# EAGLE design icp_dcs (EAGLE 6.3)
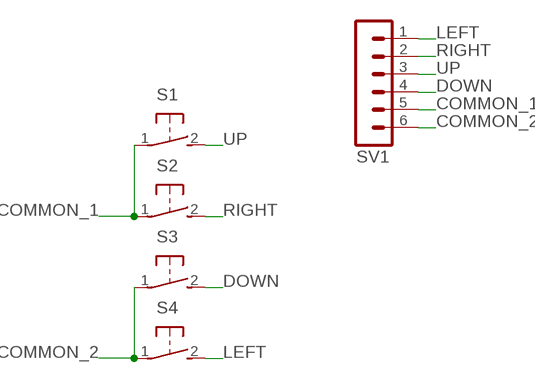
[diagram p0: schematic, sheet 1]

## Parts
S1  31-XX  [B3F-31XX]
S2  31-XX  [B3F-31XX]
S3  31-XX  [B3F-31XX]
S4  31-XX  [B3F-31XX]
SV1  MA06-1  [MA06-1]

## Nets
COMMON_1: S1.1(P) S2.1(P) SV1.5
COMMON_2: S3.1(P) S4.1(P) SV1.6
DOWN: S3.2(S) SV1.4
LEFT: S4.2(S) SV1.1
RIGHT: S2.2(S) SV1.2
UP: S1.2(S) SV1.3

## Library data of the parts
S1-S4 = switch-omron:31-XX: OMRON SWITCH; MPN: B3F-3100; OC_FARNELL: 959704; OC_NEWARK: 36M3582
SV1 = con-lstb:MA06-1: PIN HEADER; OC_FARNELL: unknown; OC_NEWARK: unknown

## Board
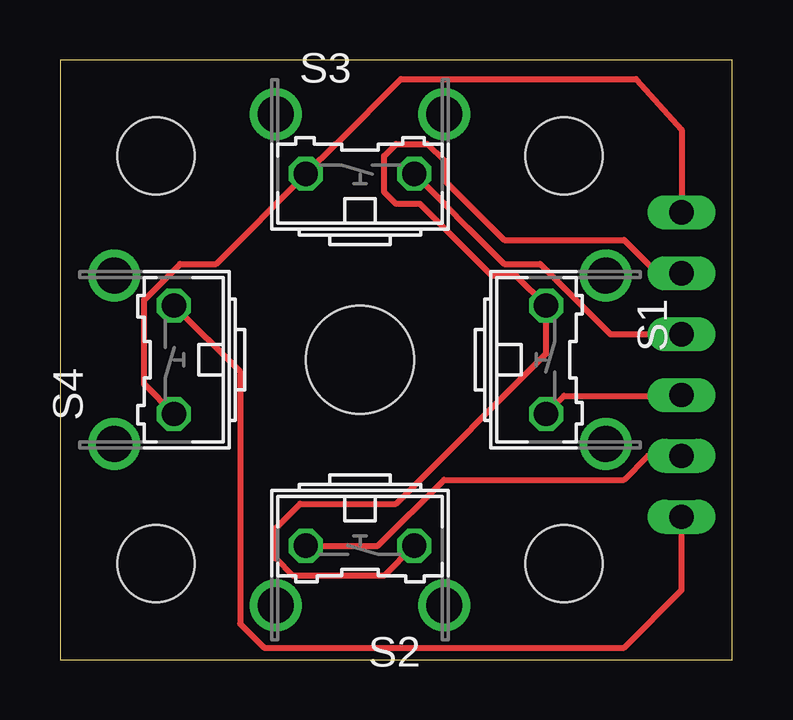
[diagram p1: board, top side]
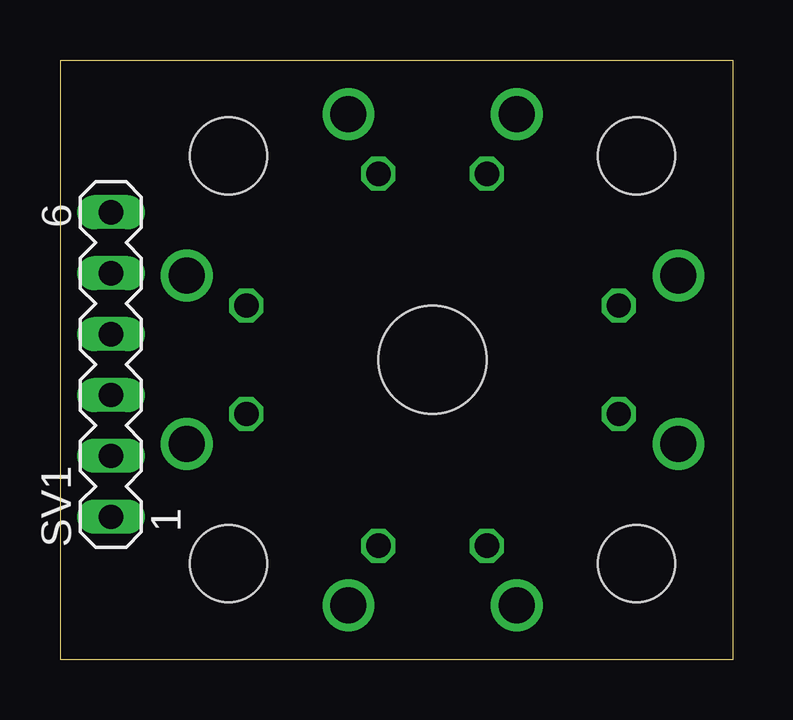
[diagram p2: board, bottom side, seen from below]

Size 28 x 25 mm. Coordinates in mm from the lower left corner, seen from the top.
Outline: 0,0 28,0 28,25 0,25 0,0
Copper layers (1*16): Top 0.035mm / dielectric 1.5mm / Bottom 0.035mm
Design rules "PCB-POOL Standard": minimum track width 0.15mm, minimum drill 0.3mm, track to track 0.15mm, track to pad 0.15mm, pad to pad 0.15mm, via to via 0.15mm, smd to smd 0.15mm, copper to edge 0.3mm, drill to drill 0.2mm, minimum pad ring 0.2mm, minimum via ring 0.15mm, stop-mask expansion 0.075mm, vias tented up to drill 0mil, thermal gap 0.2mm
Holes 3.2 mm at 4,4 4,21 21,21 21,4
Holes 4.5 mm at 12.5,12.5

### Footprints (pad centres in the part's own frame; a part is rotated, then mirrored left to right if it is on the bottom)
B3F-31XX = drill 1.016 octagon: 1 -2.261,-1.245; 2 2.261,-1.245 | drill 1.499 pad 2.159: 3 -3.505,1.245; 4 3.505,1.245
MA06-1 = drill 1.016 long: 1 -6.35,0; 2 -3.81,0; 3 -1.27,0; 4 1.27,0; 5 3.81,0; 6 6.35,0

### Placement (x,y rotation side)
S1  21.5,12.5 270 top
S2  12.5,3.5 180 top
S3  12.5,21.5 0 top
S4  3.5,12.5 90 top
SV1  25.9,12.3 90 bottom

### Tracks (layer width: path | path; a pad name or v marks a point on that pad's centre or on a via)
COMMON_1
  Top 0.254: S2.1 14.74,4.75 13.5,3.5 9.71,3.5 9,4.21 9,5.5 10,6.5 14,6.5 20.25,12.76 S1.1 19.02,16 18,16 15,19 14,19 13.5,19.5 13.5,21 14,21.5 15.29,21.5 16,20.79 16,20 18.5,17.5 23.5,17.5 24.89,16.11 SV1.5
COMMON_2
  Top 0.254: S4.1 3.5,11.48 3.5,15 5,16.5 6.5,16.5 10.24,20.24 S3.1 11.48,21.5 11.5,21.5 14.2,24.2 24,24.2 25.9,22.1 SV1.6
DOWN
  Top 0.254: S3.2 16,19.02 17,18 18.5,16.5 20,16.5 22.93,13.57 SV1.4
LEFT
  Top 0.254: S4.2 7.5,12.01 7.5,1.5 8.5,0.5 23.5,0.5 25.9,2.9 SV1.1
RIGHT
  Top 0.254: S2.2 13.24,4.75 16,7.5 23.5,7.5 24.49,8.49 SV1.2
UP
  Top 0.254: S1.2 20.24,10.24 21,11 25.87,11 SV1.3